# Altium schematic sheet Sheet2.SchDoc
size A4
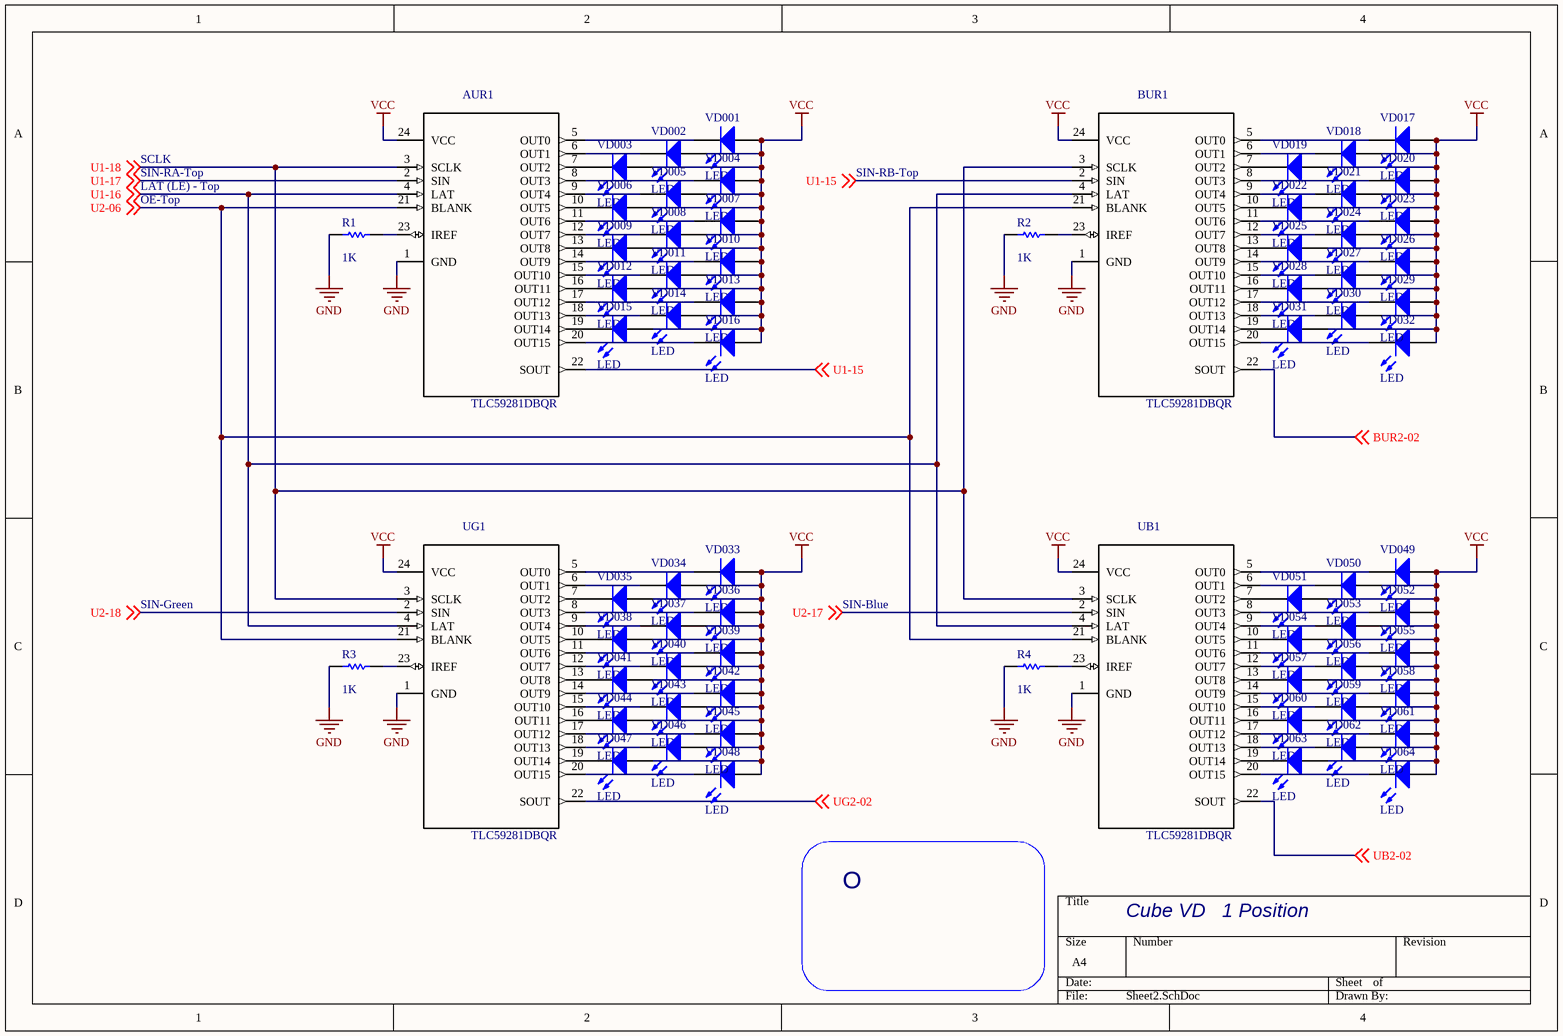
[diagram p0: Sheet2.SchDoc]

## Parts
AUR1  TLC59281DBQR  [SOP63P600X175-28N]
BUR1  TLC59281DBQR  [SOP63P600X175-28N]
R1  value 1K  [AXIAL-0.3]  (hidden comment: Res1)
R2  value 1K  [AXIAL-0.3]  (hidden comment: Res1)
R3  value 1K  [AXIAL-0.3]  (hidden comment: Res1)
R4  value 1K  [AXIAL-0.3]  (hidden comment: Res1)
UB1  TLC59281DBQR  [SOP63P600X175-28N]
UG1  TLC59281DBQR  [SOP63P600X175-28N]
VD001  LED  [LED-0]
VD002  LED  [LED-0]
VD003  LED  [LED-0]
VD004  LED  [LED-0]
VD005  LED  [LED-0]
VD006  LED  [LED-0]
VD007  LED  [LED-0]
VD008  LED  [LED-0]
VD009  LED  [LED-0]
VD010  LED  [LED-0]
VD011  LED  [LED-0]
VD012  LED  [LED-0]
VD013  LED  [LED-0]
VD014  LED  [LED-0]
VD015  LED  [LED-0]
VD016  LED  [LED-0]
VD017  LED  [LED-0]
VD018  LED  [LED-0]
VD019  LED  [LED-0]
VD020  LED  [LED-0]
VD021  LED  [LED-0]
VD022  LED  [LED-0]
VD023  LED  [LED-0]
VD024  LED  [LED-0]
VD025  LED  [LED-0]
VD026  LED  [LED-0]
VD027  LED  [LED-0]
VD028  LED  [LED-0]
VD029  LED  [LED-0]
VD030  LED  [LED-0]
VD031  LED  [LED-0]
VD032  LED  [LED-0]
VD033  LED  [LED-0]
VD034  LED  [LED-0]
VD035  LED  [LED-0]
VD036  LED  [LED-0]
VD037  LED  [LED-0]
VD038  LED  [LED-0]
VD039  LED  [LED-0]
VD040  LED  [LED-0]
VD041  LED  [LED-0]
VD042  LED  [LED-0]
VD043  LED  [LED-0]
VD044  LED  [LED-0]
VD045  LED  [LED-0]
VD046  LED  [LED-0]
VD047  LED  [LED-0]
VD048  LED  [LED-0]
VD049  LED  [LED-0]
VD050  LED  [LED-0]
VD051  LED  [LED-0]
VD052  LED  [LED-0]
VD053  LED  [LED-0]
VD054  LED  [LED-0]
VD055  LED  [LED-0]
VD056  LED  [LED-0]
VD057  LED  [LED-0]
VD058  LED  [LED-0]
VD059  LED  [LED-0]
VD060  LED  [LED-0]
VD061  LED  [LED-0]
VD062  LED  [LED-0]
VD063  LED  [LED-0]
VD064  LED  [LED-0]

## Nets
GND: AUR1.1(GND) BUR1.1(GND) R1.1 R2.1 R3.1 R4.1 UB1.1(GND) UG1.1(GND)
VCC: AUR1.24(VCC) BUR1.24(VCC) UB1.24(VCC) UG1.24(VCC) VD001.1(A) VD002.1(A) VD003.1(A) VD004.1(A) VD005.1(A) VD006.1(A) VD007.1(A) VD008.1(A) VD009.1(A) VD010.1(A) VD011.1(A) VD012.1(A) VD013.1(A) VD014.1(A) VD015.1(A) VD016.1(A) VD017.1(A) VD018.1(A) VD019.1(A) VD020.1(A) VD021.1(A) VD022.1(A) VD023.1(A) VD024.1(A) VD025.1(A) VD026.1(A) VD027.1(A) VD028.1(A) VD029.1(A) VD030.1(A) VD031.1(A) VD032.1(A) VD033.1(A) VD034.1(A) VD035.1(A) VD036.1(A) VD037.1(A) VD038.1(A) VD039.1(A) VD040.1(A) VD041.1(A) VD042.1(A) VD043.1(A) VD044.1(A) VD045.1(A) VD046.1(A) VD047.1(A) VD048.1(A) VD049.1(A) VD050.1(A) VD051.1(A) VD052.1(A) VD053.1(A) VD054.1(A) VD055.1(A) VD056.1(A) VD057.1(A) VD058.1(A) VD059.1(A) VD060.1(A) VD061.1(A) VD062.1(A) VD063.1(A) VD064.1(A)
BUR2-02: BUR1.22(SOUT) ; off-sheet BUR2-02
U1-15: AUR1.22(SOUT) BUR1.2(SIN) ; off-sheet U1-15
U1-16: AUR1.4(LAT) BUR1.4(LAT) UB1.4(LAT) UG1.4(LAT) ; off-sheet U1-16
U1-17: AUR1.2(SIN) ; off-sheet U1-17
U1-18: AUR1.3(SCLK) BUR1.3(SCLK) UB1.3(SCLK) UG1.3(SCLK) ; off-sheet U1-18
U2-06: AUR1.21(BLANK) BUR1.21(BLANK) UB1.21(BLANK) UG1.21(BLANK) ; off-sheet U2-06
U2-17: UB1.2(SIN) ; off-sheet U2-17
U2-18: UG1.2(SIN) ; off-sheet U2-18
UB2-02: UB1.22(SOUT) ; off-sheet UB2-02
UG2-02: UG1.22(SOUT) ; off-sheet UG2-02
NetAUR1_5: AUR1.5(OUT0) VD001.2(K)
NetAUR1_6: AUR1.6(OUT1) VD002.2(K)
NetAUR1_7: AUR1.7(OUT2) VD003.2(K)
NetAUR1_8: AUR1.8(OUT3) VD004.2(K)
NetAUR1_9: AUR1.9(OUT4) VD005.2(K)
NetAUR1_10: AUR1.10(OUT5) VD006.2(K)
NetAUR1_11: AUR1.11(OUT6) VD007.2(K)
NetAUR1_12: AUR1.12(OUT7) VD008.2(K)
NetAUR1_13: AUR1.13(OUT8) VD009.2(K)
NetAUR1_14: AUR1.14(OUT9) VD010.2(K)
NetAUR1_15: AUR1.15(OUT10) VD011.2(K)
NetAUR1_16: AUR1.16(OUT11) VD012.2(K)
NetAUR1_17: AUR1.17(OUT12) VD013.2(K)
NetAUR1_18: AUR1.18(OUT13) VD014.2(K)
NetAUR1_19: AUR1.19(OUT14) VD015.2(K)
NetAUR1_20: AUR1.20(OUT15) VD016.2(K)
NetAUR1_23: AUR1.23(IREF) R1.2
NetBUR1_5: BUR1.5(OUT0) VD017.2(K)
NetBUR1_6: BUR1.6(OUT1) VD018.2(K)
NetBUR1_7: BUR1.7(OUT2) VD019.2(K)
NetBUR1_8: BUR1.8(OUT3) VD020.2(K)
NetBUR1_9: BUR1.9(OUT4) VD021.2(K)
NetBUR1_10: BUR1.10(OUT5) VD022.2(K)
NetBUR1_11: BUR1.11(OUT6) VD023.2(K)
NetBUR1_12: BUR1.12(OUT7) VD024.2(K)
NetBUR1_13: BUR1.13(OUT8) VD025.2(K)
NetBUR1_14: BUR1.14(OUT9) VD026.2(K)
NetBUR1_15: BUR1.15(OUT10) VD027.2(K)
NetBUR1_16: BUR1.16(OUT11) VD028.2(K)
NetBUR1_17: BUR1.17(OUT12) VD029.2(K)
NetBUR1_18: BUR1.18(OUT13) VD030.2(K)
NetBUR1_19: BUR1.19(OUT14) VD031.2(K)
NetBUR1_20: BUR1.20(OUT15) VD032.2(K)
NetBUR1_23: BUR1.23(IREF) R2.2
NetR3_2: R3.2 UG1.23(IREF)
NetR4_2: R4.2 UB1.23(IREF)
NetUB1_5: UB1.5(OUT0) VD049.2(K)
NetUB1_6: UB1.6(OUT1) VD050.2(K)
NetUB1_7: UB1.7(OUT2) VD051.2(K)
NetUB1_8: UB1.8(OUT3) VD052.2(K)
NetUB1_9: UB1.9(OUT4) VD053.2(K)
NetUB1_10: UB1.10(OUT5) VD054.2(K)
NetUB1_11: UB1.11(OUT6) VD055.2(K)
NetUB1_12: UB1.12(OUT7) VD056.2(K)
NetUB1_13: UB1.13(OUT8) VD057.2(K)
NetUB1_14: UB1.14(OUT9) VD058.2(K)
NetUB1_15: UB1.15(OUT10) VD059.2(K)
NetUB1_16: UB1.16(OUT11) VD060.2(K)
NetUB1_17: UB1.17(OUT12) VD061.2(K)
NetUB1_18: UB1.18(OUT13) VD062.2(K)
NetUB1_19: UB1.19(OUT14) VD063.2(K)
NetUB1_20: UB1.20(OUT15) VD064.2(K)
NetUG1_5: UG1.5(OUT0) VD033.2(K)
NetUG1_6: UG1.6(OUT1) VD034.2(K)
NetUG1_7: UG1.7(OUT2) VD035.2(K)
NetUG1_8: UG1.8(OUT3) VD036.2(K)
NetUG1_9: UG1.9(OUT4) VD037.2(K)
NetUG1_10: UG1.10(OUT5) VD038.2(K)
NetUG1_11: UG1.11(OUT6) VD039.2(K)
NetUG1_12: UG1.12(OUT7) VD040.2(K)
NetUG1_13: UG1.13(OUT8) VD041.2(K)
NetUG1_14: UG1.14(OUT9) VD042.2(K)
NetUG1_15: UG1.15(OUT10) VD043.2(K)
NetUG1_16: UG1.16(OUT11) VD044.2(K)
NetUG1_17: UG1.17(OUT12) VD045.2(K)
NetUG1_18: UG1.18(OUT13) VD046.2(K)
NetUG1_19: UG1.19(OUT14) VD047.2(K)
NetUG1_20: UG1.20(OUT15) VD048.2(K)

## Notes on the sheet
- SCLK
- SIN-RA-Top
- SIN-RB-Top
- OE-Top
- LAT (LE) - Top
- SIN-Green
- SIN-Blue
- O
- Cube VD   1 Position

## Library data of the parts
AUR1 BUR1 UB1 UG1 = TLC59281DBQR: 16-Channel, Constant-Current LED Driver without LED Open Detection 24-SSOP -40 to 85; MF: Texas Instruments; Price: 0.74 USD; Availability: Good; SnapEDA_Link: https://www.snapeda.com/parts/TLC59281DBQR/Texas%20Instruments/view-part/?ref=snap; MP: TLC59281DBQR; Package: SSOP-24 Texas Instruments; Value: *
R1-R4 = Res1: Resistor; Published: 8-Jun-2000; LatestRevisionDate: 17-Jul-2002; LatestRevisionNote: Re-released for DXP Platform.; PackageReference: AXIAL-0.3; Publisher: Altium Limited; PackageDescription: Axial Device, Thru-Hole; 2 Leads; 0.3 in Pin Spacing
VD001 VD002 VD003 VD004 VD005 VD006 VD007 VD008 VD009 VD010 VD011 VD012 VD013 VD014 VD015 VD016 VD017 VD018 VD019 VD020 VD021 VD022 VD023 VD024 VD025 VD026 VD027 VD028 VD029 VD030 VD031 VD032 VD033 VD034 VD035 VD036 VD037 VD038 VD039 VD040 VD041 VD042 VD043 VD044 VD045 VD046 VD047 VD048 VD049 VD050 VD051 VD052 VD053 VD054 VD055 VD056 VD057 VD058 VD059 VD060 VD061 VD062 VD063 VD064 = LED0: Typical INFRARED GaAs LED; Published: 8-Jun-2000; LatestRevisionDate: 08-Jul-2005; LatestRevisionNote: Mech Layer 1 removed.; PackageReference: LED-0; Publisher: Altium Limited; PackageDescription: LED; 2 Leads